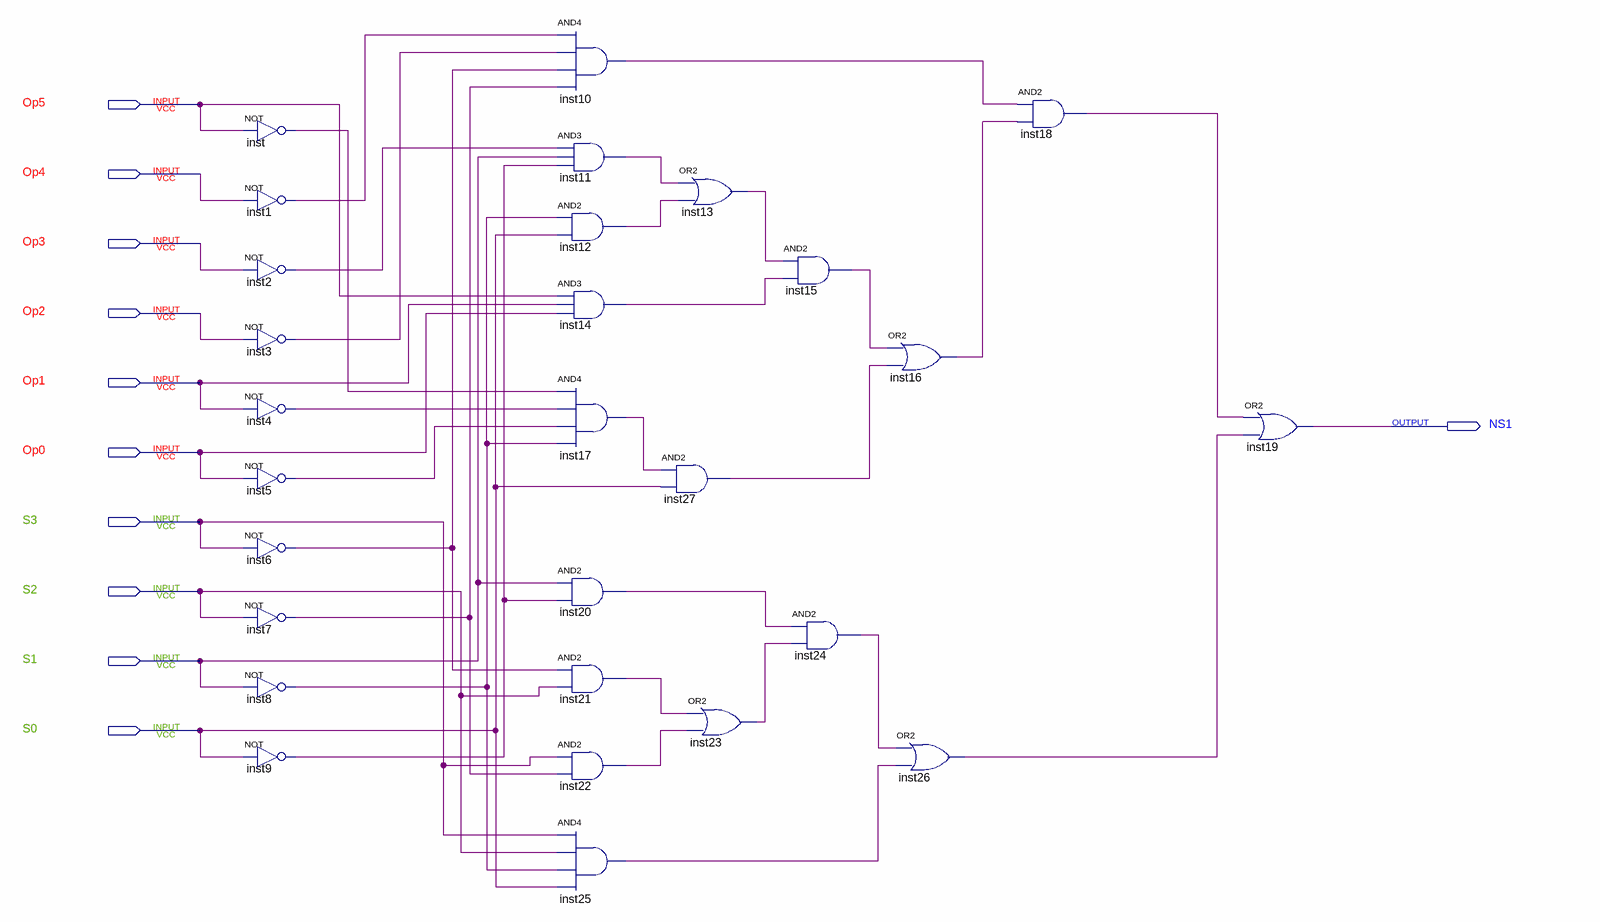
[diagram p0: schematic sheet]
// Quartus schematic NS1.bdf as structural Verilog: 28 symbols, 11 pins
module NS1 (
  input  Op5,
  input  Op4,
  input  Op3,
  input  Op2,
  input  Op1,
  input  Op0,
  input  S3,
  input  S2,
  input  S1,
  input  S0,
  output NS1
);

  wire inst1_out, inst2_out, inst3_out, inst4_out, inst5_out, inst6_out, inst7_out, inst8_out, inst9_out,
       inst10_out, inst11_out, inst12_out, inst13_out, inst14_out, inst15_out, inst16_out, inst17_out,
       inst18_out, inst20_out, inst21_out, inst22_out, inst23_out, inst24_out, inst25_out, inst26_out,
       inst27_out, inst_out;

  not inst (inst_out, Op5);
  not inst1 (inst1_out, Op4);
  not inst2 (inst2_out, Op3);
  not inst3 (inst3_out, Op2);
  not inst4 (inst4_out, Op1);
  not inst5 (inst5_out, Op0);
  not inst6 (inst6_out, S3);
  not inst7 (inst7_out, S2);
  not inst8 (inst8_out, S1);
  not inst9 (inst9_out, S0);
  and inst10 (inst10_out, inst1_out, inst3_out, inst6_out, inst7_out);
  and inst11 (inst11_out, inst2_out, S1, inst9_out);
  and inst12 (inst12_out, inst8_out, S0);
  and inst14 (inst14_out, Op5, Op1, Op0);
  and inst17 (inst17_out, inst_out, inst4_out, inst5_out, inst8_out);
  and inst20 (inst20_out, S1, inst9_out);
  and inst21 (inst21_out, inst6_out, S2);
  and inst22 (inst22_out, S3, inst7_out);
  and inst25 (inst25_out, S3, S2, inst8_out, S0);
  or inst13 (inst13_out, inst11_out, inst12_out);
  and inst27 (inst27_out, inst17_out, S0);
  or inst23 (inst23_out, inst21_out, inst22_out);
  and inst15 (inst15_out, inst13_out, inst14_out);
  and inst24 (inst24_out, inst20_out, inst23_out);
  or inst16 (inst16_out, inst15_out, inst27_out);
  or inst26 (inst26_out, inst24_out, inst25_out);
  and inst18 (inst18_out, inst10_out, inst16_out);
  or inst19 (NS1, inst18_out, inst26_out);
endmodule
